# Altium schematic sheet Powersupply.SchDoc
size A4; Organization: Rotronic AG; Address1: Grindelstrasse 6; Address2: 8303 Bassersdorf; Address3: Switzerland; DocumentNumber: 10; SheetNumber: 10; SheetTotal: 10; Web_Address: www.rotronic.ch; E_Mail_Address: *@rotronic.ch; Fon: +41 (0)44 838 11 11; Fax: +41 (0)44 836 44 24
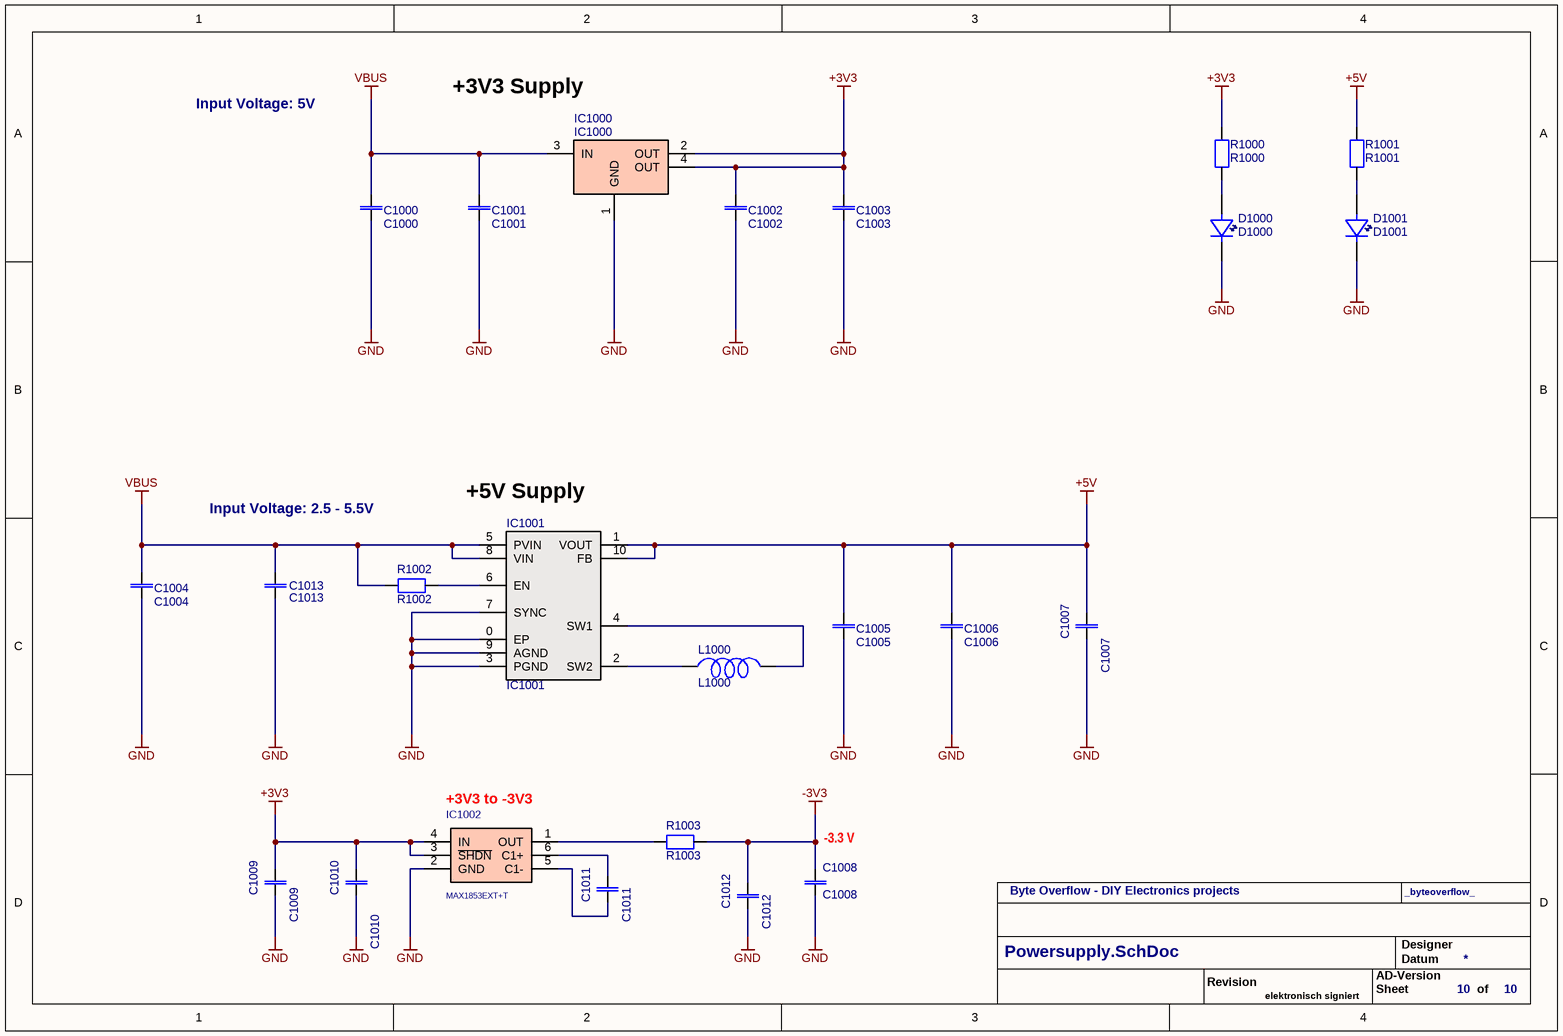
[diagram p0: Powersupply.SchDoc]

## Parts
C1000  C1000  [0805-2012]
C1001  C1001  [0805-2012]
C1002  C1002  [0805-2012]
C1003  C1003  [0805-2012]
C1004  C1004  [0805-2012]
C1005  C1005  [0805-2012]
C1006  C1006  [0805-2012]
C1007  C1007  [0805-2012]
C1008  C1008  [0805-2012]
C1009  C1009  [0402-1005]
C1010  C1010  [0805-2012]
C1011  C1011  [0402-1005]
C1012  C1012  [0402-1005]
C1013  C1013  [0805-2012]
D1000  D1000  [0805_LED]
D1001  D1001  [0805_LED]
IC1000  IC1000  [SOT-223]
IC1001  IC1001  [SON10]
IC1002  MAX1853EXT+T  [SC70-6]
L1000  L1000  [0805-2012]
R1000  R1000  [0805-2012]
R1001  R1001  [0805-2012]
R1002  R1002  [0805-2012]
R1003  R1003  [0603-1608]

## Nets
+3V3: C1002.1 C1003.1 C1009.1 C1010.1 IC1000.2(OUT) IC1000.4(OUT) IC1002.3(~{SHDN}) IC1002.4(IN) R1000.1
+5V: C1005.1 C1006.1 C1007.1 IC1001.1(VOUT) IC1001.10(FB) R1001.1
-3V3: C1008.1 C1012.1 R1003.2
GND: C1000.2 C1001.2 C1002.2 C1003.2 C1004.2 C1005.2 C1006.2 C1007.2 C1008.2 C1009.2 C1010.2 C1012.2 C1013.2 D1000.2(K) D1001.2(K) IC1000.1(GND) IC1001.0(EP) IC1001.3(PGND) IC1001.7(SYNC) IC1001.9(AGND) IC1002.2(GND)
VBUS: C1000.1 C1001.1 C1004.1 C1013.1 IC1000.3(IN) IC1001.5(PVIN) IC1001.8(VIN) R1002.1
NetC1011_1: C1011.1 IC1002.6(C1+)
NetC1011_2: C1011.2 IC1002.5(C1-)
NetD1000_1: D1000.1(A) R1000.2
NetD1001_1: D1001.1(A) R1001.2
NetIC1001_2: IC1001.2(SW2) L1000.1
NetIC1001_4: IC1001.4(SW1) L1000.2
NetIC1001_6: IC1001.6(EN) R1002.2
NetIC1002_1: IC1002.1(OUT) R1003.1

## Notes on the sheet
- Input Voltage: 5V
- +3V3 Supply
- Input Voltage: 2.5 - 5.5V
- (near IC1001) +5V Supply
- (near IC1002) +3V3 to -3V3
- (near C1008) -3.3 V
- Byte Overflow - DIY Electronics projects
- _byteoverflow_
- Revision
- AD-Version
- Designer
- Datum
- elektronisch signiert
- Sheet
- of

## Library data of the parts
C1000 C1002 = F0127: Capacitor; Part-Number: 63.0105.1500; Manufacturer: Murata Electronics North America; Manufacturer Part Number: GRM21BF51H105ZA12L; Designator: C 1uF 50V; ID: F0127; Operating Range: -30°C to +85°C; Note: 1uF 50V Y5V 20% Murata GRM21BF51H105ZA12L; Specification: 27.12.2012 OPT; Value: 1uF 50V; Component Type: Standard; ComponentLink1Description: Datasheet; ComponentLink1URL: http://www.murata.com/products/catalog/pdf/c02e.pdf; Status: Active; Availability Date: 15.11.2016 OPT; RoHS compliant: Yes; Flammability: n.a.; ComponentLink2Description: http://search.murata.co.jp/Ceramy/image/img/A01X/G101/ENG/GRM21BF51H105ZA12-01.pdf; ComponentLink2URL: http://search.murata.co.jp/Ceramy/image/img/A01X/G101/ENG/GRM21BF51H105ZA12-01.pdf; Pin Count: 2; Price 100: 0.067; Price 1000: 0.067; Price Date: 02.12.2019 Pro Alpha; Changed: 27.12.2012 OPT; Price: 0.118; Supplier 1: Digi-Key; Supplier Part Number 1: 490-3903-1-ND; Part Status: Discontinued at Digi-Key; RoHS: RoHS Compliant
C1001 C1003 = F0032: Capacitor; Part-Number: 63.0104.1000; Manufacturer: KEMET; Manufacturer Part Number: C0805C104K5RACTU; Designator: C 0.1uF 50V; ID: F0032; Operating Range: -55°C to +125°C; Note: 0.1uF 10% 50V X7R AVX 08055C104KAT2A; Specification: 19.09.2011 MLP; Verification: 05.07.2012 OPT; Value: 0.1uF 50V; Component Type: Standard; ComponentLink1Description: http://www.kemet.com/docfinder?Partnumber=C0805C104K5RACTU; ComponentLink1URL: http://www.kemet.com/docfinder?Partnumber=C0805C104K5RACTU; Status: Active; Availability Date: 15.11.2016 OPT; RoHS compliant: Yes; Flammability: n.a.; Pin Count: 2; Price 100: 0.011; Price 1000: 0.011; Price Date: 02.12.2019 Pro Alpha; Changed: 19.09.2011 MLP; Price: 0.015; Supplier 1: Digi-Key; Supplier Part Number 1: 399-1170-1-ND; Part Status: Active; RoHS: RoHS Compliant
C1004-C1006 = F0002: Capacitor; Part-Number: 63.7000.0120; Manufacturer: AVX Corporation; Manufacturer Part Number: 0805YD106KAT2A; Designator: C 10uF 16V; ID: F0002; Operating Range: -55°C to +85°C; Note: 10uF 10% 16V X5R AVX 0805YD106KAT2A; Specification: 10.11.2011 MLP; Verification: 05.07.2012 OPT; Value: 10uF 16V; Component Type: Standard; ComponentLink1Description: Datasheet; ComponentLink1URL: http://www.murata.com/products/catalog/pdf/c02e.pdf; Status: Active; Availability Date: 15.11.2016 OPT; RoHS compliant: Yes; Flammability: n.a.; ComponentLink2Description: http://datasheets.avx.com/cx5r.pdf; ComponentLink2URL: http://datasheets.avx.com/cx5r.pdf; Pin Count: 2; Price 100: 0.087; Price 1000: 0.068; Price Date: 02.12.2019 Pro Alpha; Changed: 10.11.2011 MLP; Price: 0.062; Supplier 1: Digi-Key; Supplier Part Number 1: 478-5165-1-ND; Part Status: Active; RoHS: RoHS Compliant
C1007 C1008 C1010 C1013 = F0032: Capacitor; Part-Number: 63.0104.1000; Manufacturer: KEMET; Manufacturer Part Number: C0805C104K5RACTU; ID: F0032; Operating Range: -55°C to +125°C; Note: 0.1uF 10% 50V X7R AVX 08055C104KAT2A; Specification: 19.09.2011 MLP; Value: 0.1uF 50V; Verification: 05.07.2012 OPT; Designator: C 0.1uF 50V; Component Type: Standard; ComponentLink1Description: http://www.kemet.com/docfinder?Partnumber=C0805C104K5RACTU; ComponentLink1URL: http://www.kemet.com/docfinder?Partnumber=C0805C104K5RACTU; Status: Active; Availability Date: 15.11.2016 OPT; RoHS compliant: Yes; Flammability: n.a.; Pin Count: 2; Price 100: 0.011; Price 1000: 0.011; Price Date: 02.12.2019 Pro Alpha; Changed: 19.09.2011 MLP; Price: 0.015; Supplier 1: Digi-Key; Supplier Part Number 1: 399-1170-1-ND; Part Status: Active; RoHS: RoHS Compliant
C1009 C1012 = F0101: Capacitor; Part-Number: 63.7000.0150; Manufacturer: Johanson Dielectrics Inc.; Manufacturer Part Number: 6R3R07X225MV4T; Designator: C 2.2uF 6.3V; ID: F0101; Operating Range: -55°C to +85°C; Note: 2.2uF 6.3V 20% X5R Johanson Dielectrics 6R3R07X225MV4T; Specification: 14.11.2014 OPT; Value: 2.2uF 6.3V; Component Type: Standard; ComponentLink1Description: Datasheet; ComponentLink1URL: http://www.mouser.com/ds/2/611/JDI_Tanceram_High-Cap-2013-04-242302.pdf; Pin Count: 2; Price 100: 0.093; Price 1000: 0.074; Price Date: 02.12.2019 Pro Alpha; Changed: 14.11.2014 OPT; Price: 0.123; Availability Date: 15.11.2016 OPT; Flammability: n.a.; RoHS compliant: Yes; Status: Active; ComponentLink2Description: https://www.johansondielectrics.com/downloads/JDI-Tanceram.pdf; ComponentLink2URL: https://www.johansondielectrics.com/downloads/JDI-Tanceram.pdf; Part Status: Active; RoHS: RoHS Compliant; Supplier Part Number 1: 709-1223-1-ND; Supplier 1: Digi-Key
C1011 = F0091: Capacitor; Part-Number: 63.7000.0020; Manufacturer: KEMET; Manufacturer Part Number: C0402C105K9PACTU; Designator: C 1uF 6.3V; ID: F0091; Operating Range: -55°C to +125°C; Note: 1uF X5R 6.3V 10% Taiyo Yuden JMK105BJ105KV-F; Specification: 19.09.2011 MLP; Verification: 05.07.2012 OPT; Value: 1uF 6.3V; Component Type: Standard; Pin Count: 2; Price 100: 0.004; Price 1000: 0.004; Price Date: 02.12.2019 Pro Alpha; Changed: 19.09.2011 MLP; Price: 0.006; Availability Date: 15.11.2016 OPT; Flammability: n.a.; RoHS compliant: Yes; Status: Active; ComponentLink1Description: http://www.kemet.com/docfinder?Partnumber=C0402C105K9PACTU; ComponentLink1URL: http://www.kemet.com/docfinder?Partnumber=C0402C105K9PACTU; Part Status: Active; RoHS: RoHS Compliant; Supplier Part Number 1: 399-4873-1-ND; Supplier 1: Digi-Key
D1000 D1001 = A0053: LED; Part-Number: 00.0000.0000; Manufacturer: Dialight; Manufacturer Part Number: 5988170107F; Designator: LED SMD 0805; ID: A0053; Operating Range: -30°C to +85°C; Note: LED SMD 0805 Green Dialight 598-8170-107F; Value: LED SMD 0805; Specification: 27.12.2012 OPT; Verification: 25.01.2013 MLP; Component Type: Standard; ComponentLink1Description: Datasheet; ComponentLink1URL: http://www.dialight.com/Assets/Brochures_And_Catalogs/Indication/598_SelectorGuide.pdf; Status: Active; Availability Date: 14.11.2016 OPT; RoHS compliant: Yes; Flammability: n.a.; Pin Count: 2; Price 100: 0.092; Price 1000: 0.075; Changed: 27.12.2012 OPT; Price: 0.092; Price Date: 17.09.2014 OPT; Supplier: Digi-Key; Supplier Part Number: 350-2044-1-ND; Part Status: Active; RoHS: RoHS Compliant
IC1000 = K0059: Voltage regulator; Part-Number: 00.0000.0000; Manufacturer: Texas Instruments; Manufacturer Part Number: TLV1117LV33DCYR; Designator: TLV1117LV33DCY; ID: K0059; Operating Range: -40°C to +125°C; Note: Ti TLV1117LV33DCY 3.3V 1A pos. fixed Voltage LDO; Changed: 14.09.2016 OPT; Value: TLV1117LV33DCY; Component Type: Standard; ComponentLink1Description: Datasheet; ComponentLink1URL: http://www.ti.com/lit/ds/symlink/tlv1117lv.pdf; Status: Active; Availability Date: 14.09.2016 OPT; RoHS compliant: Yes; Flammability: n.a.; Pin Count: 4; Price 100: 0.33; Price 1000: 0.265; Price Date: 14.09.2016 OPT; Specification: 14.09.2016 OPT; Price: 0.607; Supplier 1: Digi-Key; Supplier Part Number 1: 296-28778-1-ND; Part Status: Active; RoHS: RoHS Compliant
IC1001 = K0067: Voltage regulator; Part-Number: 00.0000.0000; Manufacturer: Analog Devices; Manufacturer Part Number: 584-ADP2503ACPZ5.0R7; Designator: ADP2503ACPZ-5.0-R7; ID: K0067; Operating Range: -40°C to +125°C; Note: Schaltspannungsregler 5V 600mA, Buck Boost Converter; Changed: 27.10.2022 PEK; Value: ADP2503ACPZ-5.0-R7; Component Type: Standard; ComponentLink1Description: Datasheet; ComponentLink1URL: https://www.mouser.ch/datasheet/2/609/ADP2503_2504-1503443.pdf; Status: Active; Availability Date: 27.10.2022 PEK; RoHS compliant: Yes; Flammability: n.a; Pin Count: 10; Price 100: 3.70; Price 1000: 2.68; Price Date: 27.10.2022 PEK; Specification: 27.10.2022 PEK; Price: 5.04; Supplier 1: Mouser; Supplier Part Number 1: 584-ADP2503ACPZ5.0R7; Part Status: Active; RoHS: RoHS Compliant
IC1002 = K0070: Voltage regulator; Part-Number: 00.0000.0000; Manufacturer: Maxim Integrated; Artikel-Nr.: 61.1836.9600; Preis(CHF): 2.7000; ID: K0070; Operating Range: -40°C to +125°C; Note: Schaltspannungsregler SC70-6 Inverting Charge Pumps with Shutdown MAX1853EXT+T; Changed: 27.10.2022 PEK; Value: MAX1853EXT+T; Component Type: Standard; ComponentLink1Description: Datasheet; ComponentLink1URL: https://www.mouser.ch/datasheet/2/256/MAX1852-MAX1853-1273825.pdf; Status: Active; Availability Date: 27.10.2022 PEK; RoHS compliant: Yes; Flammability: n.a; Pin Count: 6; Price 100: 1.58; Price 1000: 1.11; Price Date: 27.10.2022 PEK; Specification: 27.10.2022 PEK; Price: 2.19; Supplier 1: Mouser; Supplier Part Number 1: 700-MAX1853EXT+T; Manufacturer Part Number: MAX1853EXT+T; Part Status: Active; RoHS: RoHS Compliant
L1000 = M0085: Inductor; Part-Number: 00.0000.0000; Manufacturer: TDK; Manufacturer Part Number: ADL2012-1R5M-T01; Designator: L 1.5uH 0.5A; ID: M0085; Operating Range: -40°C to +125°C; Note: Festinduktivitäten 1.5uH 10% 0.56A CWF2414; Specification: 27.10.2022 PEK; Value: L 1.5uH 0.5A; Component Type: Standard; ComponentLink1Description: Datasheet; ComponentLink1URL: https://product.tdk.com/system/files/dam/doc/product/inductor/inductor/smd/catalog/inductor_automotive_decoupling_adl2012_en.pdf; Status: Active; Availability Date: 27.10.2022 PEK; RoHS compliant: Yes; Flammability: n.a.; Pin Count: 2; Price 100: 0.37; Price 1000: 0.26; Price Date: 27.10.2022 PEK; Changed: 27.10.2022 PEK; Price: 0.62; Supplier 1: Mouser; Supplier Part Number 1: 810-ADL2012-1R5M-T01; Part Status: Active; RoHS: RoHS Compliant
R1000 R1001 = Q0422: Resistor; Part-Number: 00.0000.0000; Manufacturer: Panasonic Electronic Components; Manufacturer Part Number: ERJ-6ENF5600V; Designator: R 560E 1%; ID: Q0422; Operating Range: -55°C to +155°C; Note: Dickfilmwiderstände - SMD 0805 560ohms 1% AEC-Q200; Changed: 15.11.2019 PEK; Value: 560E 1%; Component Type: Standard; ComponentLink1Description: Datasheet; ComponentLink1URL: https://www.mouser.ch/datasheet/2/315/AOA0000C304-1149620.pdf; Status: Active; Availability Date: 15.11.2019 PEK; RoHS compliant: Yes; Flammability: n.a.; Pin Count: 2; Price 100: 0.03; Price 1000: 0.011; Price Date: 15.11.2019 PEK; Specification: 15.11.2019 PEK; Price: 0.098; Supplier: Mouser; Supplier Part Number: 667-ERJ-6ENF5600V; Part Status: Active; RoHS: RoHS Compliant
R1002 = Q0244: Resistor; Part-Number: 71.0000.0500; Manufacturer: Vishay Dale; Manufacturer Part Number: CRCW08050000Z0EAHP; Designator: R 0E 1%; ID: Q0244; Operating Range: -55°C to +155°C; Note: 0E 1.0% Vishay/Dale CRCW08050000Z0EA; Changed: 23.04.2013 OPT; Verification: 05.03.2013 ENP; Value: 0E 1%; Component Type: Standard; ComponentLink1Description: Datasheet; ComponentLink1URL: http://www.mouser.com/ds/2/427/dcrcwe3-109170.pdf; Status: Active; Availability Date: 16.11.2016 OPT; RoHS compliant: Yes; Flammability: n.a.; ComponentLink2Description: http://www.vishay.com/docs/20043/crcwhpe3.pdf; ComponentLink2URL: http://www.vishay.com/docs/20043/crcwhpe3.pdf; Pin Count: 2; Price 100: 0.007; Price 1000: 0.007; Price Date: 02.12.2019 Pro Alpha; Specification: 23.04.2013 OPT; Price: 0.005; Supplier: Digi-Key; Supplier Part Number: 541-0.0TBCT-ND; Part Status: Active; RoHS: RoHS Compliant
R1003 = Q0389: Resistor; Part-Number: 71.1009.1500; Manufacturer: Vishay Dale; Manufacturer Part Number: CRCW060310R0FKEA; Designator: R 10E 1%; ID: Q0389; Operating Range: -55°C to +155°C; Note: 10E 1% 100ppm 1/10W Vishay CRCW060310R0FKEA; Changed: 21.09.2016 OPT; Verification: 26.09.2016 ENP; Value: 10E 1%; Component Type: Standard; ComponentLink1Description: Datasheet; ComponentLink1URL: http://www.vishay.com/docs/20035/dcrcwe3.pdf; Status: Active; Availability Date: 21.09.2016 OPT; RoHS compliant: Yes; Flammability: n.a.; Pin Count: 2; Price 100: 0.026; Price 1000: 0.018; Price Date: 02.12.2019 Pro Alpha; Specification: 21.09.2016 OPT; Price: 0.043; Supplier: Digi-Key; Supplier Part Number: 541-10.0HCT-ND; Part Status: Active; RoHS: RoHS Compliant